# Altium schematic sheet PN532.SchDoc
size A4
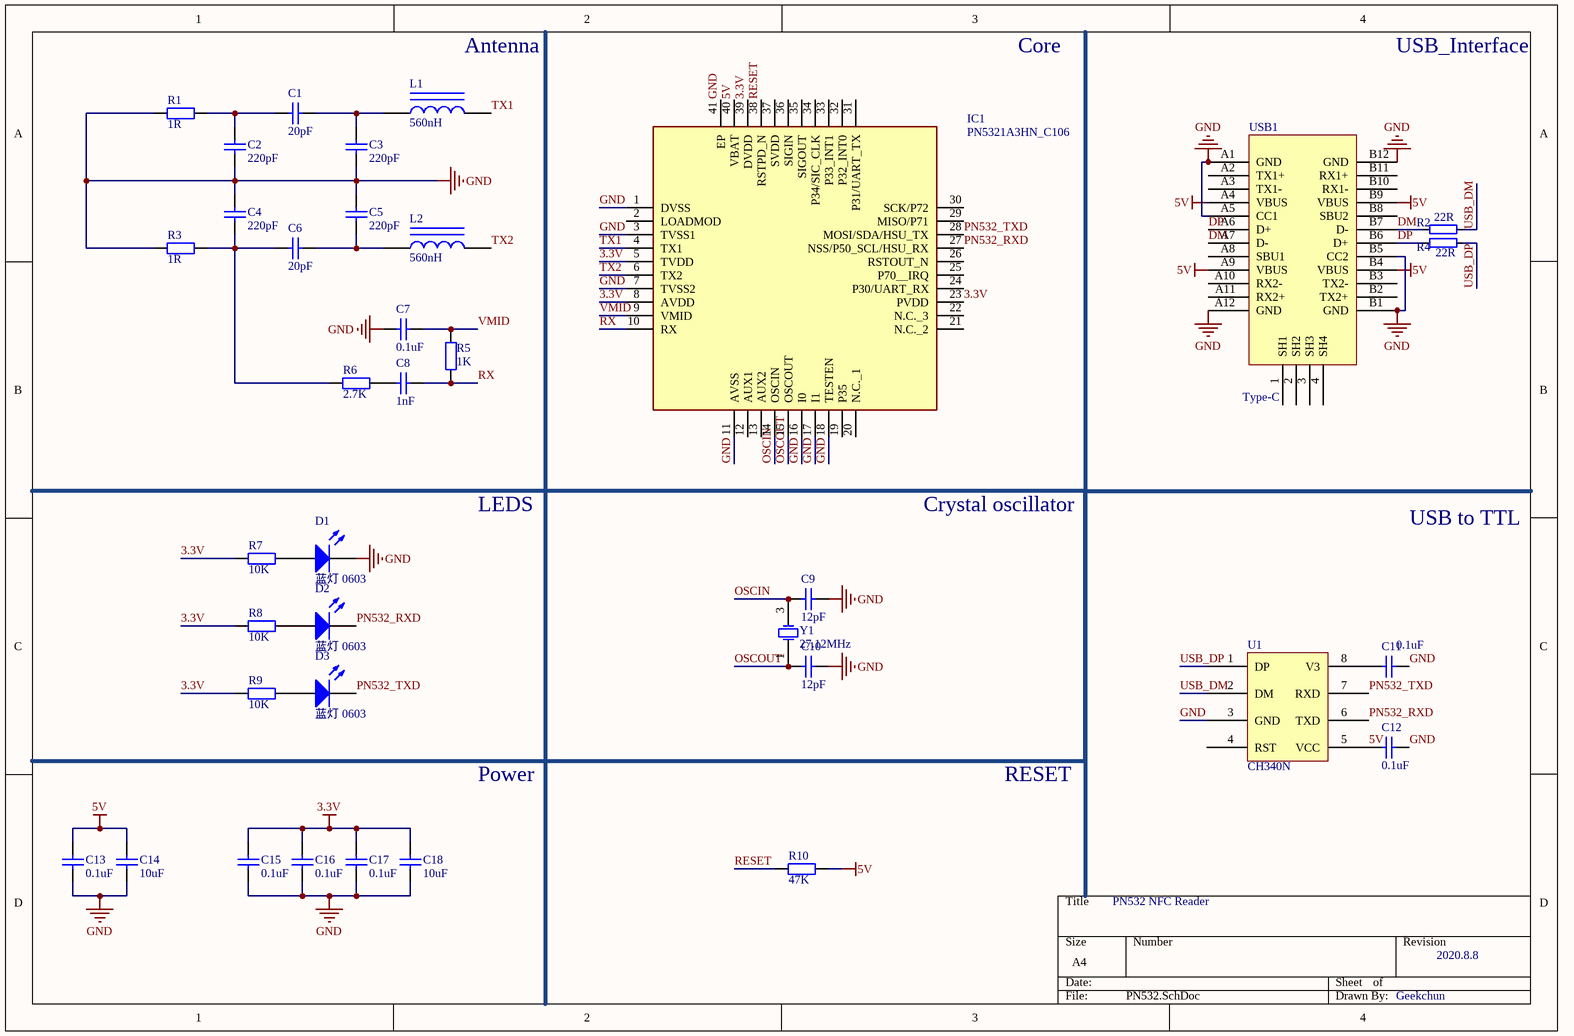
[diagram p0: PN532.SchDoc]

## Parts
C1  20pF  [C 0402_L]
C2  220pF  [C 0402_L]
C3  220pF  [C 0402_L]
C4  220pF  [C 0402_L]
C5  220pF  [C 0402_L]
C6  20pF  [C 0402_L]
C7  0.1uF  [C 0402_L]
C8  1nF  [C 0402_L]
C9  12pF  [C 0402_L]
C10  12pF  [C 0402_L]
C11  0.1uF  [C 0402_L]
C12  0.1uF  [C 0402_L]
C13  0.1uF  [C 0402_L]
C14  10uF  [C 0402_L]
C15  0.1uF  [C 0402_L]
C16  0.1uF  [C 0402_L]
C17  0.1uF  [C 0402_L]
C18  10uF  [C 0402_L]
D1  蓝灯 0603  [0603_LED_S1]
D2  蓝灯 0603  [0603_LED_S1]
D3  蓝灯 0603  [0603_LED_S1]
IC1  PN5321A3HN_C106  [QFN40 6X6_L]
L1  560nH  [0402_L]
L2  560nH  [0402_L]
R1  1R  [R 0402_L]
R2  22R  [R 0402_L]
R3  1R  [R 0402_L]
R4  22R  [R 0402_L]
R5  1K  [R 0402_L]
R6  2.7K  [R 0402_L]
R7  10K  [R 0402_L]
R8  10K  [R 0402_L]
R9  10K  [R 0402_L]
R10  47K  [R 0402_L]
U1  CH340N  [SOP8_L]
USB1  Type-C  [usb typec]
Y1  27.12MHz  [OSC 3225-4P]

## Nets
3.3V: C15.2 C16.2 C17.2 C18.2 IC1.5(TVDD) IC1.8(AVDD) IC1.23(PVDD) IC1.39(DVDD) R7.1 R8.1 R9.1
5V: C12.1 C13.2 C14.2 IC1.40(VBAT) R10.2 U1.5(VCC) USB1.A4(VBUS) USB1.A9(VBUS) USB1.B4(VBUS) USB1.B9(VBUS)
GND: C2.2 C3.2 C4.1 C5.1 C7.1 C9.1 C10.1 C11.1 C12.2 C13.1 C14.1 C15.1 C16.1 C17.1 C18.1 D1.K IC1.1(DVSS) IC1.3(TVSS1) IC1.7(TVSS2) IC1.11(AVSS) IC1.16(I0) IC1.17(I1) IC1.18(TESTEN) IC1.41(EP) R1.1 R3.1 U1.3(GND) USB1.A1(GND) USB1.A5(CC1) USB1.A12(GND) USB1.B1(GND) USB1.B5(CC2) USB1.B12(GND)
DM: R2.1 USB1.A7(D-) USB1.B7(D-)
DP: R4.1 USB1.A6(D+) USB1.B6(D+)
OSCIN: C9.2 IC1.14(OSCIN) Y1.3(OSC2)
OSCOUT: C10.2 IC1.15(OSCOUT) Y1.1(OSC1)
PN532_RXD: D2.K IC1.27(NSS/P50_SCL/HSU_RX) U1.6(TXD)
PN532_TXD: D3.K IC1.28(MOSI/SDA/HSU_TX) U1.7(RXD)
RESET: IC1.38(RSTPD_N) R10.1
RX: C8.2 IC1.10(RX) R5.1
TX1: IC1.4(TX1) L1.2
TX2: IC1.6(TX2) L2.2
USB_DM: R2.2 U1.2(DM)
USB_DP: R4.2 U1.1(DP)
VMID: C7.2 IC1.9(VMID) R5.2
NetC1_1: C1.1 C2.1 R1.2
NetC1_2: C1.2 C3.1 L1.1
NetC4_2: C4.2 C6.1 R3.2 R6.1
NetC5_2: C5.2 C6.2 L2.1
NetC8_1: C8.1 R6.2
NetC11_2: C11.2 U1.8(V3)
NetD1_A: D1.A R7.2
NetD2_A: D2.A R8.2
NetD3_A: D3.A R9.2

Not connected (* = marked no-connect by the designer): IC1 2(LOADMOD) 12(AUX1) 13(AUX2) 19(P35) 20(N.C._1) 21(N.C._2) 22(N.C._3) 24(P30/UART_RX) 25(P70__IRQ) 26(RSTOUT_N) 29(MISO/P71) 30(SCK/P72) 31(P31/UART_TX) 32(P32_INT0) 33(P33_INT1) 34(P34/SIC_CLK) 35(SIGOUT) 36(SIGIN) 37(SVDD); U1 4(RST); USB1 1(SH1) 2(SH2) 3(SH3) 4(SH4) A2(TX1+) A3(TX1-) A8(SBU1) A10(RX2-) A11(RX2+) B2(TX2+) B3(TX2-) B8(SBU2) B10(RX1-) B11(RX1+)

## Notes on the sheet
- Antenna
- Core
- USB_Interface
- LEDS
- Crystal oscillator
- USB to TTL
- Power
- RESET
- PN532 NFC Reader
- 2020.8.8
- Geekchun

## Library data of the parts
C1-C18 = 0402 1.0uF (105) 10% 25V: 贴片电容; ComponentLink1Description: 供应商链接; ComponentLink1URL: http://www.szlcsc.com/product/details_53938.html; Package: 0402; Supplier: LC; SuppliersPartNumber: C52923
D1-D3 = 0603 蓝灯: 发光二极管; ComponentLink1Description: 供应商链接; ComponentLink1URL: http://www.szlcsc.com/product/details_73150.html; Package: 0603; Supplier: LC; SuppliersPartNumber: C72041
IC1 = PN5321A3HN_C106;55: Integrated Circuit; Manufacturer_Name: NXP; Manufacturer_Part_Number: PN5321A3HN/C106;55; Datasheet Link: http://www.nxp.com/docs/en/nxp/data-sheets/PN532_C1.pdf; Height: 1mm; Arrow Part Number: PN5321A3HN/C106;55; Arrow Price/Stock: https://www.arrow.com/en/products/pn5321a3hnc10655/nxp-semiconductors; Mouser Part Number: 771-PN5321A3HNC106; Mouser Price/Stock: https://www.mouser.co.uk/ProductDetail/NXP-Semiconductors/PN5321A3HN-C10655?qs=pw%2F%252B4fOKvQs%252BEDLBAp%252B%252BeA%3D%3D
L1 L2 = 0402 12nH  5%: 贴片电感; ComponentLink1Description: 供应商链接; ComponentLink1URL: http://www.szlcsc.com/product/details_25303.html; Package: 0402; Supplier: LC; SuppliersPartNumber: C24563
R1 R3 R5-R10 = 0402 1.2KΩ (1201) 1%: 贴片电阻; ComponentLink1Description: 供应商链接; ComponentLink1URL: http://www.szlcsc.com/product/details_26605.html; Package: 0402; Supplier: LC; SuppliersPartNumber: C25862
R2 R4 = RES
Y1 = SMD-3225_4P  12MHZ 20PF 10PPM: 贴片晶振; ComponentLink1Description: 供应商链接; ComponentLink1URL: http://www.szlcsc.com/product/details_9522.html; Package: SMD-3225_4P; Supplier: LC; SuppliersPartNumber: C9002